# EAGLE design Programmieradapter (EAGLE 7.5.0)
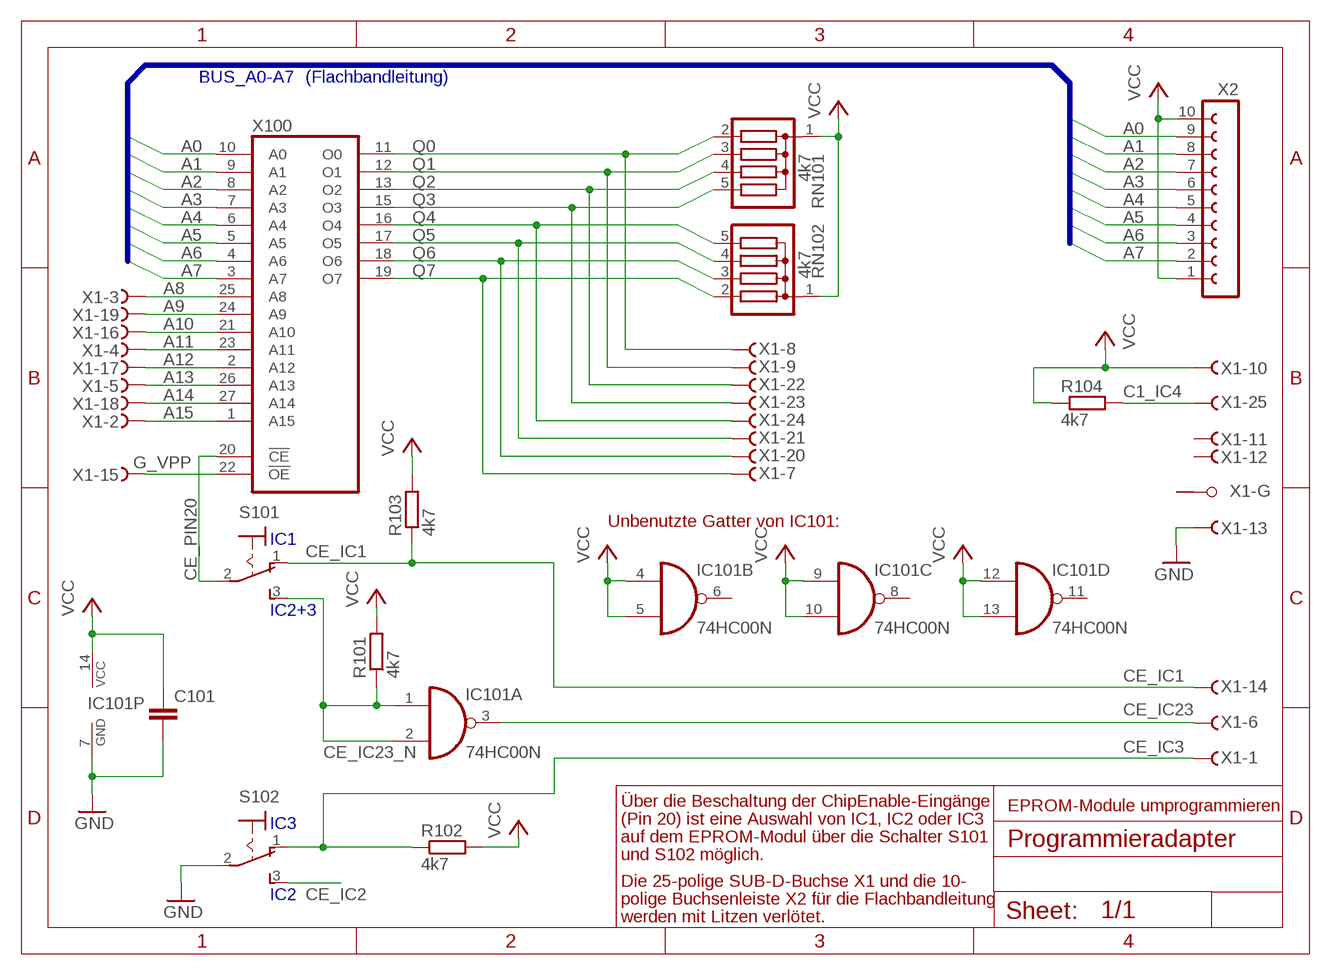
[diagram p0: schematic, sheet 1]

## Parts
C101  C-EU050-024X044  [C050-024X044]
IC101  74HC00N  [DIL14]
R101  4k7  R-EU_0207/10  [0207/10]
R102  4k7  R-EU_0207/10  [0207/10]
R103  4k7  R-EU_0207/10  [0207/10]
R104  4k7  R-EU_0207/10  [0207/10]
RN101  4k7  G04R  [SIL5]
RN102  4k7  G04R  [SIL5]
S101  320-916  [320-916]
S102  320-916  [320-916]
X1  F25VPS  [F25VP]
X2  FE10-1  [FE10]
X100  27512  [DIL28]

## Nets
A0: X2.9 X100.10(A0)
A1: X2.8 X100.9(A1)
A2: X2.7 X100.8(A2)
A3: X2.6 X100.7(A3)
A4: X2.5 X100.6(A4)
A5: X2.4 X100.5(A5)
A6: X2.3 X100.4(A6)
A7: X2.2 X100.3(A7)
A8: X1.3(-3:F) X100.25(A8)
A9: X1.19(-19:F) X100.24(A9)
A10: X1.16(-16:F) X100.21(A10)
A11: X1.4(-4:F) X100.23(A11)
A12: X1.17(-17:F) X100.2(A12)
A13: X1.5(-5:F) X100.26(A13)
A14: X1.18(-18:F) X100.27(A14)
A15: X1.2(-2:F) X100.1(A15)
C1_IC4: R104.2 X1.25(-25:F)
CE_IC1: R103.1 S101.1(O) X1.14(-14:F)
CE_IC2: S102.3(S)
CE_IC3: R102.1 S102.1(O) X1.1(-1:F)
CE_IC23: IC101.3(A:O) X1.6(-6:F)
CE_IC23_N: IC101.1(A:I0) IC101.2(A:I1) R101.1 S101.3(S)
CE_PIN20: S101.2(P) X100.20(!CE)
G_VPP: X1.15(-15:F) X100.22(!OE)
GND: C101.2 IC101.7(P:GND) S102.2(P) X1.13(-13:F)
Q0: RN101.2 X1.8(-8:F) X100.11(O0)
Q1: RN101.3 X1.9(-9:F) X100.12(O1)
Q2: RN101.4 X1.22(-22:F) X100.13(O2)
Q3: RN101.5 X1.23(-23:F) X100.15(O3)
Q4: RN102.5 X1.24(-24:F) X100.16(O4)
Q5: RN102.4 X1.21(-21:F) X100.17(O5)
Q6: RN102.3 X1.20(-20:F) X100.18(O6)
Q7: RN102.2 X1.7(-7:F) X100.19(O7)
VCC: C101.1 IC101.4(B:I0) IC101.5(B:I1) IC101.9(C:I0) IC101.10(C:I1) IC101.12(D:I0) IC101.13(D:I1) IC101.14(P:VCC) R101.2 R102.2 R103.2 R104.1 RN101.1 RN102.1 X1.10(-10:F) X2.1 X2.10
Unconnected: IC101.6(B:O) IC101.8(C:O) IC101.11(D:O) X1.11(-11:F) X1.12(-12:F) X1.G1(-G:G1) X1.G2(-G:G2)

## Buses
BUS_A0-A7

## Notes on the sheet
- (Flachbandleitung)
- Unbenutzte Gatter von IC101:
- IC1
- IC2+3
- Über die Beschaltung der ChipEnable-Eingänge | EPROM-Module umprogrammieren
- IC3 | (Pin 20) ist eine Auswahl von IC1, IC2 oder IC3
- auf dem EPROM-Modul über die Schalter S101
- und S102 möglich.
- Die 25-polige SUB-D-Buchse X1 und die 10-
- IC2 | polige Buchsenleiste X2 für die Flachbandleitung
- werden mit Litzen verlötet.

## Power pins joined to a net without a drawn wire
GND: X100.14(GND)
VCC: X100.28(VCC)

## Library data of the parts
C101 = rcl:C-EU: CAPACITOR, European symbol
IC101 = 74xx-eu:74*00: Quad 2-input NAND gate
R101-R104 = rcl:R-EU_: RESISTOR, European symbol
RN101 RN102 = resistor-sil:G04R: SIL RESISTOR; OC_FARNELL: unknown; OC_NEWARK: unknown
S101 S102 = switch:320-916: TOGGLE SWITCH distributor RS Components
X1 = con-subd:F25VPS: SUB-D; OC_FARNELL: unknown; OC_NEWARK: unknown
X2 = con-lsta:FE10-1: FEMALE HEADER; OC_FARNELL: unknown; OC_NEWARK: unknown
X100 = memory:27512: MEMORY

## Board
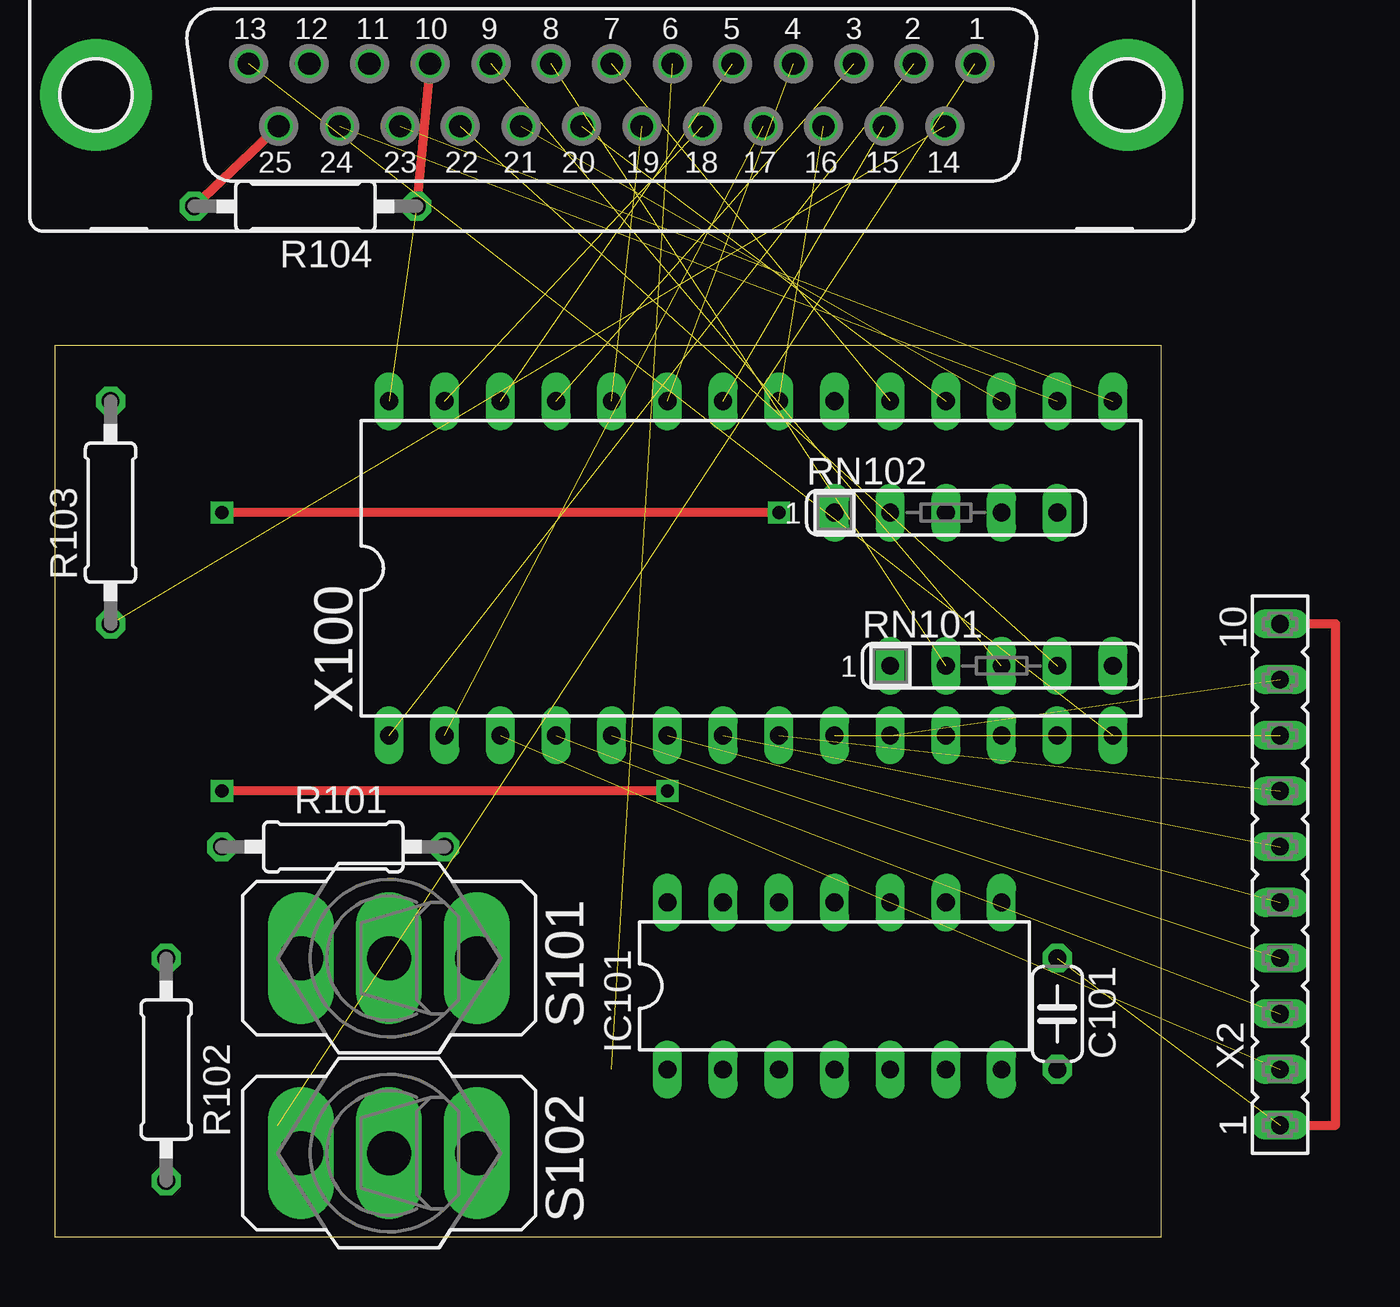
[diagram p1: board, top side]
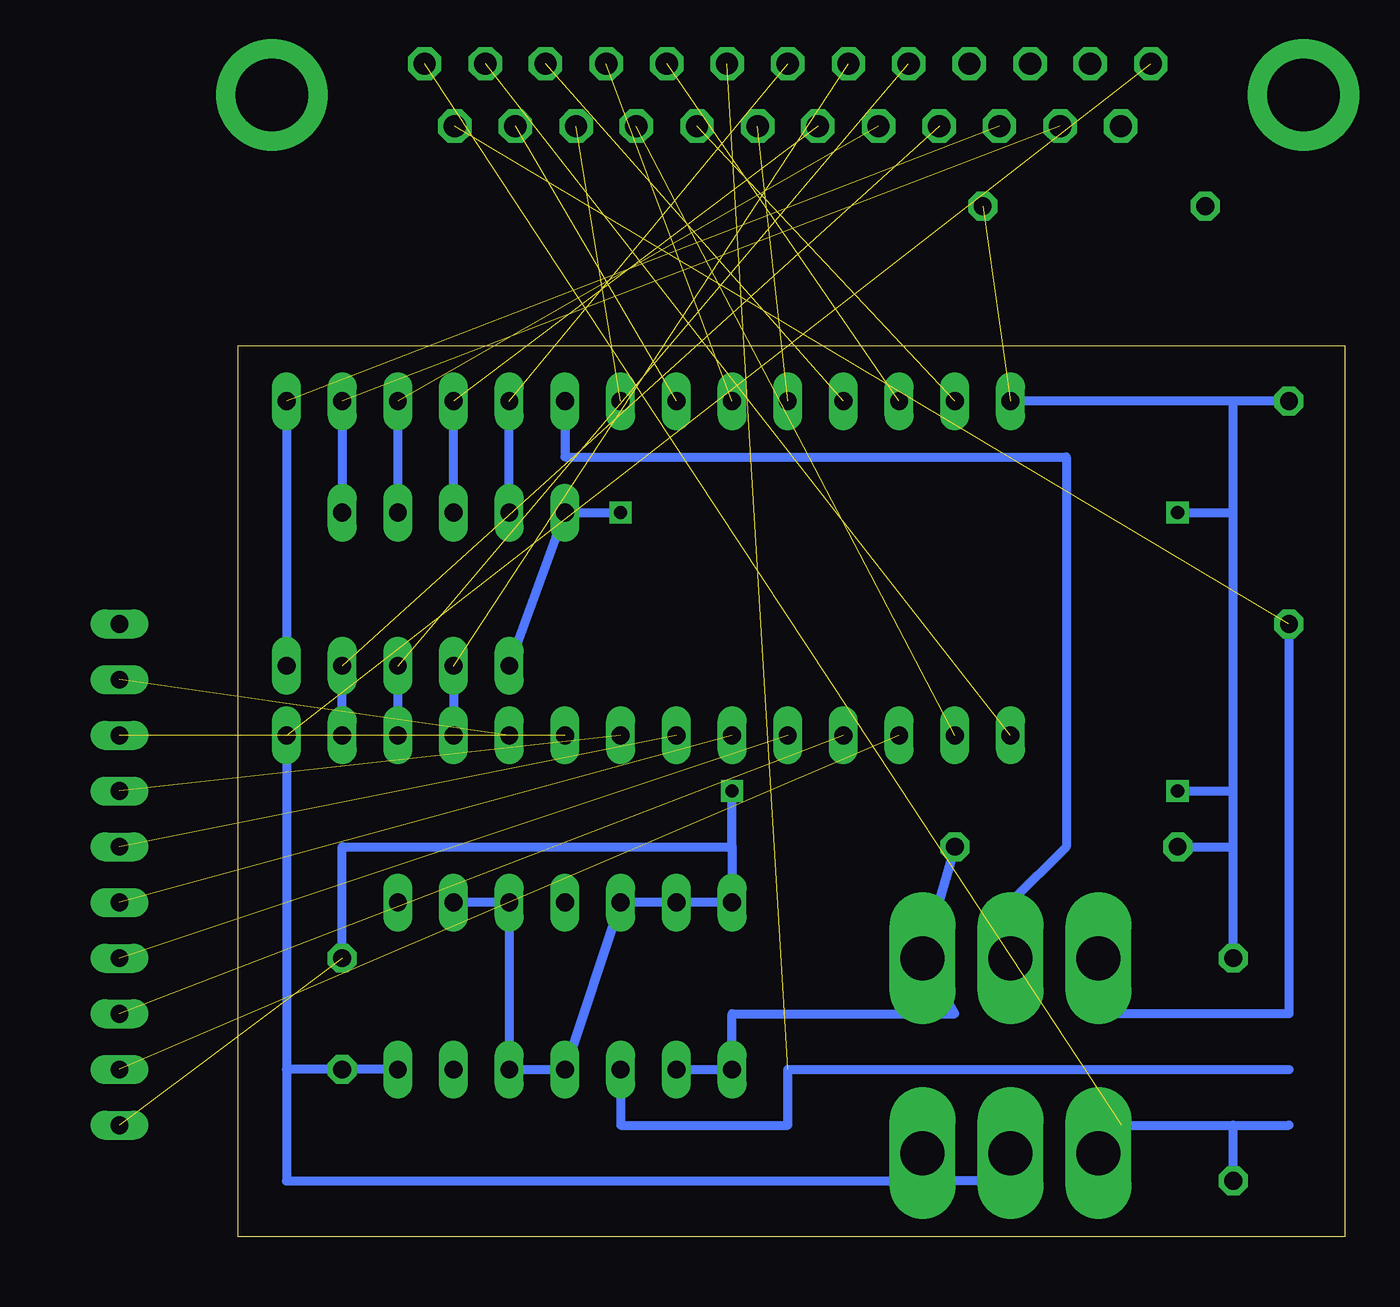
[diagram p2: board, bottom side, seen from below]

Size 50.47 x 40.63 mm. Coordinates in mm from the lower left corner, seen from the top.
Outline: 0,0 50.47,0 50.47,40.63 0,40.63 0,0
Copper layers (1*16): Top 0.035mm / dielectric 1.5mm / Bottom 0.035mm
Design rules "default": minimum track width 10mil, minimum drill 24mil, track to track 8mil, track to pad 8mil, pad to pad 8mil, via to via 8mil, smd to smd 8mil, copper to edge 40mil, drill to drill 8mil, minimum pad ring 10mil, minimum via ring 8mil, stop-mask expansion 4mil, vias tented up to drill 0mil, thermal gap 10mil

### Footprints (pad centres in the part's own frame; a part is rotated, then mirrored left to right if it is on the bottom)
C050-024X044 = drill 0.813 octagon: 1 -2.54,0; 2 2.54,0
DIL14 = drill 0.813 long: 1 -7.62,-3.81; 2 -5.08,-3.81; 3 -2.54,-3.81; 4 0,-3.81; 5 2.54,-3.81; 6 5.08,-3.81; 7 7.62,-3.81; 8 7.62,3.81; 9 5.08,3.81; 10 2.54,3.81; 11 0,3.81; 12 -2.54,3.81; 13 -5.08,3.81; 14 -7.62,3.81
0207/10 = drill 0.813 octagon: 1 -5.08,0; 2 5.08,0
SIL5 = drill 0.813 long: 1 -5.08,0; 2 -2.54,0; 3 0,0; 4 2.54,0; 5 5.08,0
320-916 = drill 2.007 long: 1 0,4.013; 2 0,0; 3 0,-4.013
F25VP = drill 1.016 octagon: 1 16.561,1.422; 2 13.792,1.422; 3 11.049,1.422; 4 8.28,1.422; 5 5.512,1.422; 6 2.769,1.422; 7 0,1.422; 8 -2.769,1.422; 9 -5.512,1.422; 10 -8.28,1.422; 11 -11.049,1.422; 12 -13.792,1.422; 13 -16.561,1.422; 14 15.189,-1.422; 15 12.421,-1.422; 16 9.652,-1.422; 17 6.909,-1.422; 18 4.14,-1.422; 19 1.372,-1.422; 20 -1.372,-1.422; 21 -4.14,-1.422; 22 -6.909,-1.422; 23 -9.652,-1.422; 24 -12.421,-1.422; 25 -15.189,-1.422 | drill 3.302 pad 5.08: G1 -23.52,0; G2 23.52,0
FE10 = drill 0.813 long: 1 -11.43,0; 2 -8.89,0; 3 -6.35,0; 4 -3.81,0; 5 -1.27,0; 6 1.27,0; 7 3.81,0; 8 6.35,0; 9 8.89,0; 10 11.43,0
DIL28 = drill 0.813 long: 1 -16.51,-7.62; 2 -13.97,-7.62; 3 -11.43,-7.62; 4 -8.89,-7.62; 5 -6.35,-7.62; 6 -3.81,-7.62; 7 -1.27,-7.62; 8 1.27,-7.62; 9 3.81,-7.62; 10 6.35,-7.62; 11 8.89,-7.62; 12 11.43,-7.62; 13 13.97,-7.62; 14 16.51,-7.62; 15 16.51,7.62; 16 13.97,7.62; 17 11.43,7.62; 18 8.89,7.62; 19 6.35,7.62; 20 3.81,7.62; 21 1.27,7.62; 22 -1.27,7.62; 23 -3.81,7.62; 24 -6.35,7.62; 25 -8.89,7.62; 26 -11.43,7.62; 27 -13.97,7.62; 28 -16.51,7.62

### Placement (x,y rotation side)
C101  45.72,10.16 270 top
IC101  35.56,11.43 0 top
R101  12.7,17.78 180 top
R102  5.08,7.62 90 top
R103  2.54,33.02 90 top
R104  11.43,46.99 180 top  (outside the outline)
RN101  43.18,26.04 0 top
RN102  40.64,33.02 0 top
S101  15.24,12.7 90 top
S102  15.24,3.81 90 top
X1  25.4,52.07 0 top  (outside the outline)
X2  55.88,16.51 90 top  (outside the outline)
X100  31.75,30.48 0 top

### Tracks (layer width: path | path; a pad name or v marks a point on that pad's centre or on a via)
A0  (1 unrouted)
A1  (1 unrouted)
A2  (1 unrouted)
A3  (1 unrouted)
A4  (1 unrouted)
A5  (1 unrouted)
A6  (1 unrouted)
A7  (1 unrouted)
A8  (1 unrouted)
A9  (1 unrouted)
A10  (1 unrouted)
A11  (1 unrouted)
A12  (1 unrouted)
A13  (1 unrouted)
A14  (1 unrouted)
A15  (1 unrouted)
C1_IC4
  Top 0.406: R104.2 X1.25
CE_IC1  (1 unrouted)
  Bottom 0.406: R103.1 2.54,10.16 11.43,10.16 11.43,12.7 S101.1
CE_IC3  (1 unrouted)
  Bottom 0.406: 5.08,5.08 10.16,5.08 S102.1 | R102.1 5.08,5.08 | 5.08,5.08 2.54,5.08
CE_IC23  (1 unrouted)
  Bottom 0.406: IC101.3 33.02,5.08 25.4,5.08 25.4,7.62 2.54,7.62
CE_IC23_N
  Bottom 0.406: IC101.2 IC101.1 27.94,10.16 17.78,10.16 S101.3 R101.1
CE_PIN20
  Bottom 0.406: X100.20 35.56,35.56 12.7,35.56 12.7,17.78 15.24,15.24 S101.2
G_VPP  (1 unrouted)
GND  (1 unrouted)
  Bottom 0.406: IC101.7 C101.2 48.26,7.62 | 48.26,7.62 48.26,2.54 19.05,2.54 | X100.14 48.26,7.62 | 19.05,2.54 19.05,3.81 | S102.2 15.24,2.54 19.05,2.54
Q0  (1 unrouted)
  Bottom 0.406: RN101.2 X100.11
Q1  (1 unrouted)
  Bottom 0.406: X100.12 RN101.3
Q2  (1 unrouted)
  Bottom 0.406: X100.13 RN101.4
Q3  (1 unrouted)
  Bottom 0.406: X100.15 RN101.5
Q4  (1 unrouted)
  Bottom 0.406: X100.16 RN102.5
Q5  (1 unrouted)
  Bottom 0.406: RN102.4 X100.17
Q6  (1 unrouted)
  Bottom 0.406: RN102.3 X100.18
Q7  (1 unrouted)
  Bottom 0.406: RN102.2 X100.19
VCC  (via drill 0.6)  (2 unrouted)
  Top 0.406: v33.02,33.02 v7.62,33.02 | v27.94,20.32 v7.62,20.32 | X2.1 58.42,5.08 58.42,27.94 X2.10 | X1.10 R104.1
  Bottom 0.406: R102.2 5.08,17.78 | 5.08,17.78 5.08,20.32 | 5.08,20.32 5.08,33.02 | 5.08,33.02 5.08,38.1 | 5.08,38.1 X100.28 | RN101.1 RN102.1 v33.02,33.02 | C101.1 45.72,17.78 27.94,17.78 | 27.94,17.78 v27.94,20.32 | 27.94,17.78 IC101.14 IC101.13 IC101.12 IC101.4 IC101.5 IC101.10 IC101.9 | R103.2 5.08,38.1 | R101.2 5.08,17.78 | v7.62,33.02 5.08,33.02 | v7.62,20.32 5.08,20.32

### Text on the board
tDocu: Adapter für EPROM-Module | Bestückseite | SUB-D-Buchse für Modulstecker | Flachbandleitung | Lochrasterplatine
bDocu: Adapter für EPROM-Module | Lötseite | Lochrasterplatine